# Altium schematic sheet 01_Power.SchDoc
size A4
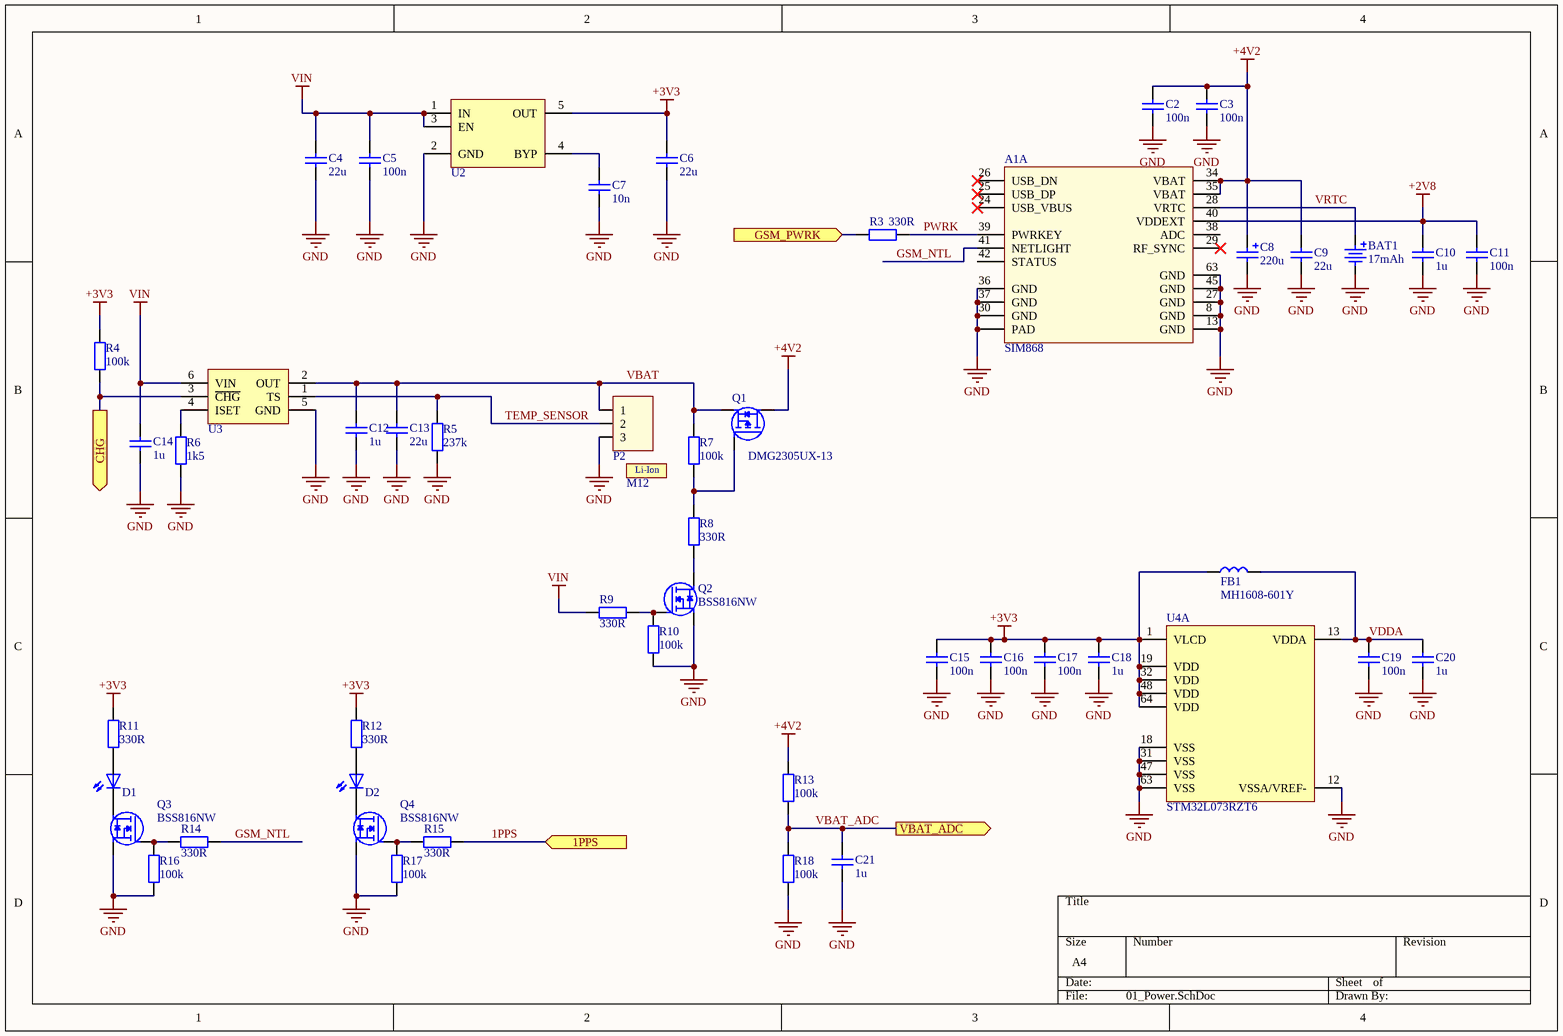
[diagram p0: 01_Power.SchDoc]

## Parts
A1  SIM868  [SIM868]  (part A of 2)
BAT1  17mAh  [ML1220]
C2  100n  [C0603_IPC_MD]
C3  100n  [C0603_IPC_MD]
C4  22u  [C0805_IPC_HD]
C5  100n  [C0603_IPC_MD]
C6  22u  [C0805_IPC_HD]
C7  10n  [C0603_IPC_MD]
C8  220u  [TANT_CAP_7343]
C9  22u  [C0805_IPC_HD]
C10  1u  [C0603_IPC_MD]
C11  100n  [C0603_IPC_MD]
C12  1u  [C0603_IPC_MD]
C13  22u  [C0805_IPC_HD]
C14  1u  [C0603_IPC_MD]
C15  100n  [C0603_IPC_MD]
C16  100n  [C0603_IPC_MD]
C17  100n  [C0603_IPC_MD]
C18  1u  [C0603_IPC_MD]
C19  100n  [C0603_IPC_MD]
C20  1u  [C0603_IPC_MD]
C21  1u  [C0603_IPC_MD]
D1  LTL-4231N  [LED3MM_HOLDER]  (value not drawn)
D2  LTL-4231N  [LED3MM_HOLDER]  (value not drawn)
FB1  MH1608-601Y  [L0603_IPC_MD]
M12  Li-Ion-1000mAh  (value not drawn)  (mechanical)
P2  JST_3V_1.25MM  [JST_1.25MM_3V]  (value not drawn)
Q1  DMG2305UX-13  [SOT23]
Q2  BSS816NW  [SOT323]
Q3  BSS816NW  [SOT323]
Q4  BSS816NW  [SOT323]
R3  330R  [R0603_IPC_MD]
R4  100k  [R0603_IPC_MD]
R5  237k  [R0603_IPC_MD]
R6  1k5  [R0603_IPC_MD]
R7  100k  [R0603_IPC_MD]
R8  330R  [R0603_IPC_MD]
R9  330R  [R0603_IPC_MD]
R10  100k  [R0603_IPC_MD]
R11  330R  [R0603_IPC_MD]
R12  330R  [R0603_IPC_MD]
R13  100k  [R0603_IPC_MD]
R14  330R  [R0603_IPC_MD]
R15  330R  [R0603_IPC_MD]
R16  100k  [R0603_IPC_MD]
R17  100k  [R0603_IPC_MD]
R18  100k  [R0603_IPC_MD]
U2  MIC5219-3.3YM5-TR  [SOT23-5_(MT)]  (value not drawn)
U3  BQ21040DBVR  [SOT23-6]  (value not drawn)
U4  STM32L073RZT6  [LQFP64_10X10MM]  (part A of 2)

## Ports
1PPS (in), CHG (out), GSM_PWRK (in), VBAT_ADC (out)

## Nets
+2V8: A1.40(VDDEXT) C10.2 C11.2
+3V3: C6.1 C15.2 C16.2 C17.2 C18.2 FB1.1 R4.2 R11.2 R12.2 U2.5(OUT) U4.1(VLCD) U4.19(VDD) U4.32(VDD) U4.48(VDD) U4.64(VDD)
+4V2: A1.34(VBAT) A1.35(VBAT) C2.2 C3.2 C8.1 C9.1 Q1.3(D) R13.2
GND: A1.8(GND) A1.13(GND) A1.27(GND) A1.30(GND) A1.36(GND) A1.37(GND) A1.45(GND) A1.63(GND) A1.PAD BAT1.2 C2.1 C3.1 C4.2 C5.2 C6.2 C7.1 C8.2 C9.2 C10.1 C11.1 C12.1 C13.2 C14.1 C15.1 C16.1 C17.1 C18.1 C19.1 C20.1 C21.1 P2.3 Q2.2(S) Q3.2(S) Q4.2(S) R5.1 R6.1 R10.1 R16.1 R17.1 R18.1 U2.2(GND) U3.5(GND) U4.12(VSSA/VREF-) U4.18(VSS) U4.31(VSS) U4.47(VSS) U4.63(VSS)
VIN: C4.1 C5.1 C14.2 R9.2 U2.1(IN) U2.3(EN) U3.6(VIN)
1PPS: R15.2 ; port 1PPS
CHG: R4.1 U3.3(~{CHG}) ; port CHG
GSM_NTL: A1.41(NETLIGHT) R14.2
GSM_PWRK: R3.1 ; port GSM_PWRK
PWRK: A1.39(PWRKEY) R3.2
TEMP_SENSOR: P2.2 R5.2 U3.1(TS)
VBAT: C12.2 C13.1 P2.1 Q1.2(S) R7.2 U3.2(OUT)
VBAT_ADC: C21.2 R13.1 R18.2 ; port VBAT_ADC
VDDA: C19.2 C20.2 FB1.2 U4.13(VDDA)
VRTC: A1.28(VRTC) BAT1.1
NetC7_2: C7.2 U2.4(BYP)
NetD1_1: D1.1(C) Q3.3(D)
NetD1_2: D1.2(A) R11.1
NetD2_1: D2.1(C) Q4.3(D)
NetD2_2: D2.2(A) R12.1
NetQ1_1: Q1.1(G) R7.1 R8.2
NetQ2_1: Q2.1(G) R9.1 R10.2
NetQ2_3: Q2.3(D) R8.1
NetQ3_1: Q3.1(G) R14.1 R16.2
NetQ4_1: Q4.1(G) R15.1 R17.2
NetR6_2: R6.2 U3.4(ISET)

Not connected (* = marked no-connect by the designer): A1 24(USB_VBUS)* 25(USB_DP)* 26(USB_DN)* 29(RF_SYNC)* 38(ADC) 42(STATUS)

## Notes on the sheet
- (in symbol Li-Ion-1000mAh) Li-Ion

## Library data of the parts
A1 = SIM868: GSM & GPRS & GPS Modules PCBModule RoHS; Manufacturer: SIMCom Wireless Solutions; Manufacturer Part Number: SIM868; Supplier 1: LCSC; Supplier Part Number 1: C89549
BAT1 = ML1220: BATT LITH 3V 17MAH COIN 12.5MM; Manufacturer: China; Manufacturer Part Number: ML1220; Value: 17mAh; Voltage: 3V; Supplier 1: Aliexpress; Supplier Part Number 1: ML1220
C2 C3 C5 C11 C15-C17 C19 = CL10B104KO8NNNC: CAP CER 0.1UF 16V X7R 0603; Manufacturer: Samsung Electro-Mechanics; Manufacturer Part Number: CL10B104KO8NNNC; Voltage: 16V; Value: 100n; Dielectric: X7R; Supplier 1: Digi-Key; Supplier Part Number 1: 1276-1005-1-ND
C4 C6 C9 C13 = CL21A226MOCLRNC: CAP CER 22UF 16V X5R 0805; Manufacturer: Samsung Electro-Mechanics; Manufacturer Part Number: CL21A226MOCLRNC; Voltage: 16V; Value: 22u; Dielectric: X5R; Supplier 1: Digi-Key; Supplier Part Number 1: 1276-6780-1-ND
C7 = CL10B103KB8NNNC: CAP CER 0.01UF 50V X7R 0603; Manufacturer: Samsung Electro-Mechanics; Manufacturer Part Number: CL10B103KB8NNNC; Voltage: 50V; Value: 10n; Dielectric: X7R; Supplier 1: Digi-Key; Supplier Part Number 1: 1276-1009-1-ND
C8 = 6TPE220MI: Tantalum Capacitors 220uF 6.3V CASE-D_7343 RoHS; Manufacturer: PANASONIC; Manufacturer Part Number: 6TPE220MI; Value: 220u; Voltage: 6.3V; Supplier 1: LCSC; Supplier Part Number 1: C129173
C10 C12 C14 C18 C20 C21 = CL10B105MO8NNWC: CAP CER 1UF 16V X7R 0603; Manufacturer: Samsung Electro-Mechanics; Manufacturer Part Number: CL10B105MO8NNWC; Voltage: 16V; Value: 1u; Dielectric: X7R; Supplier 1: Digi-Key; Supplier Part Number 1: 1276-6524-1-ND
D1 D2 = LTL-4231N: Light Emitting Diodes (LED) Green 569nm 12.6mcd@10mA Top View DIP3mm RoHS; Manufacturer: Lite-On; Manufacturer Part Number: LTL-4231N; Supplier 1: LCSC; Supplier Part Number 1: C125082
FB1 = MH1608-601Y: FERRITE BEAD 600R@100MHz 0603 for Power Line, 1000mA; Manufacturer: Bourns Inc.; Manufacturer Part Number: MH1608-601Y; Supplier 1: Digi-Key; Supplier Part Number 1: MH1608-601YCT-ND
M12 = Li-Ion-1000mAh: Nano SimCard; Manufacturer: China; Manufacturer Part Number: Li-Ion-1000mAh; Supplier 1: Aliexpress; Supplier Part Number 1: Li-Ion-1000mAh
P2 = JST_3V_1.25MM: 1.25mm Pitch Connector Micro JST Horizontal Straight Pin 3; Manufacturer: China; Manufacturer Part Number: JST_3V_1.25MM; Supplier 1: Aliexpress; Supplier Part Number 1: JST_3V_1.25MM
Q1 = DMG2305: MOSFET P-CH 20V 4.2A SOT23; Manufacturer: Diodes Inc.; Manufacturer Part Number: DMG2305UX-13; Supplier 1: Digi-Key; Supplier Part Number 1: DMG2305UX-13DICT-ND
Q2-Q4 = BSS816: N-Channel Logic Level Enhancement Mode Field Effect Transistor; Manufacturer: Infineon Technologies; Manufacturer Part Number: BSS816NW; Supplier 1: Digi-Key; Supplier Part Number 1: BSS816NWH6327XTSA1CT-ND
R3 R8 R9 R11 R12 R14 R15 = CR0603-JW-331ELF: RES SMD 330 OHM 5% 1/10W 0603; Manufacturer: Bourns Inc.; Value: 330R; Tolarance: 5%; Manufacturer Part Number: CR0603-JW-331ELF; Supplier 1: Digi-Key; Supplier Part Number 1: CR0603-JW-331ELFCT-ND
R4 R7 R10 R13 R16-R18 = RMCF0603FT100K: RES 100K OHM 1% 1/10W 0603; Manufacturer: Bourns Inc.; Value: 100k; Tolarance: 1%; Manufacturer Part Number: RMCF0603FT100K; Supplier 1: Digi-Key; Supplier Part Number 1: RMCF0603FT100KCT-ND
R5 = RC0603FR-07237KL: RES SMD 237K OHM 1% 1/10W 0603; Manufacturer: YAGEO; Value: 237k; Tolarance: 1%; Manufacturer Part Number: RC0603FR-07237KL; Supplier 1: Digi-Key; Supplier Part Number 1: 311-237KHRCT-ND
R6 = RC0603JR-071K5L: RES SMD 1.5K OHM 5% 1/10W 0603; Manufacturer: Yageo; Value: 1k5; Tolarance: 5%; Manufacturer Part Number: RC0603JR-071K5L; Supplier 1: Digi-Key; Supplier Part Number 1: 311-1.5KGRCT-ND
U2 = MIC5219-3.3YM5-TR: IC REG LINEAR 3.3V 500MA SOT23-5; Manufacturer: Microchip Technology; Manufacturer Part Number: MIC5219-3.3YM5-TR; Supplier 1: Digi-Key; Supplier Part Number 1: 576-1281-1-ND
U3 = BQ21040DBVR: IC BAT CHG LI-ION 1 CELL SOT23-6; Manufacturer: Texas Instruments; Manufacturer Part Number: BQ21040DBVR; Supplier 1: Digi-Key; Supplier Part Number 1: 296-47315-1-ND
U4 = STM32L073RZT6: Ultra-low-power 32-bit MCU ARM®-based Cortex®-M0+; Manufacturer: ST; SRAM: 20KB; FLASH: 192KB; Manufacturer Part Number: STM32L073RZT6; Supplier 1: Digi-Key; Supplier Part Number 1: 497-16270-ND